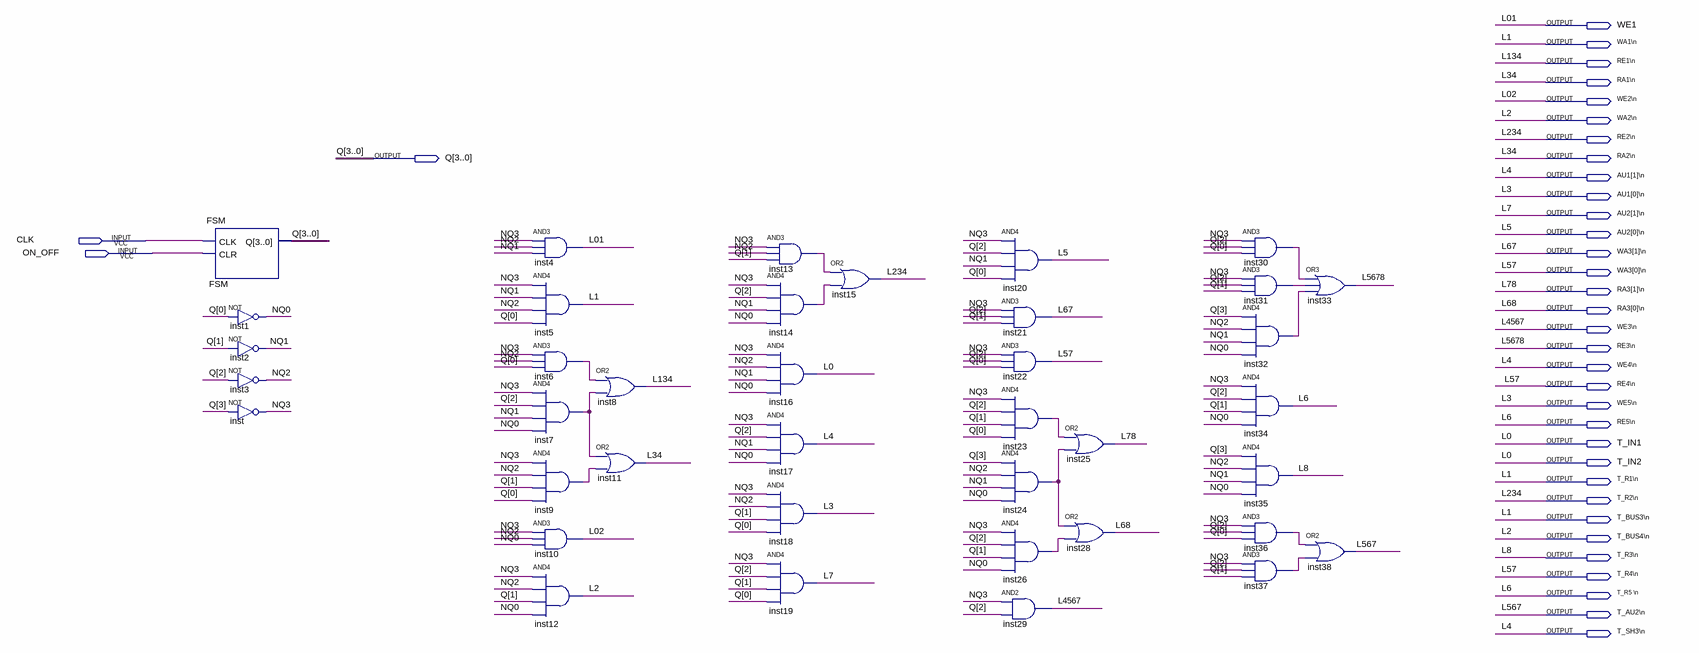
[diagram p0: schematic sheet]
// Quartus schematic NEW_CONTROLLER.bdf as structural Verilog: 39 symbols, 36 pins
module NEW_CONTROLLER (
  input  CLK,
  input  ON_OFF,
  output WE1,
  output \WA1\n ,
  output \RE1\n ,
  output \RA1\n ,
  output \WE2\n ,
  output \WA2\n ,
  output \RE2\n ,
  output [3:0] Q,
  output \RA2\n ,
  output \AU1[1]\n ,
  output \AU1[0]\n ,
  output \AU2[1]\n ,
  output \AU2[0]\n ,
  output \WA3[1]\n ,
  output \WA3[0]\n ,
  output \RA3[1]\n ,
  output \RA3[0]\n ,
  output \WE3\n ,
  output \RE3\n ,
  output \WE4\n ,
  output \RE4\n ,
  output \WE5\n ,
  output \RE5\n ,
  output T_IN1,
  output T_IN2,
  output \T_R1\n ,
  output \T_R2\n ,
  output \T_BUS3\n ,
  output \T_BUS4\n ,
  output \T_R3\n ,
  output \T_R4\n ,
  output \T_R5_\n ,
  output \T_AU2\n ,
  output \T_SH3\n 
);

  wire inst6_out, inst7_out, inst9_out, inst13_out, inst14_out, inst23_out, inst24_out, inst26_out,
       inst30_out, inst31_out, inst32_out, inst36_out, inst37_out, NQ0, NQ1, NQ2, NQ3;

  FSM FSM (.CLK(CLK), .CLR(ON_OFF), .Q(Q));
  not inst1 (NQ0, Q[0]);
  not inst2 (NQ1, Q[1]);
  not inst3 (NQ2, Q[2]);
  not inst (NQ3, Q[3]);
  and inst4 (WE1, NQ3, NQ2, NQ1);
  and inst5 (\T_BUS3\n , NQ3, NQ1, NQ2, Q[0]);
  and inst6 (inst6_out, NQ3, NQ2, Q[0]);
  and inst7 (inst7_out, NQ3, Q[2], NQ1, NQ0);
  and inst9 (inst9_out, NQ3, NQ2, Q[1], Q[0]);
  and inst10 (\WE2\n , NQ3, NQ2, NQ0);
  and inst12 (\T_BUS4\n , NQ3, NQ2, Q[1], NQ0);
  or inst8 (\RE1\n , inst6_out, inst7_out);
  or inst11 (\RA1\n , inst7_out, inst9_out);
  and inst13 (inst13_out, NQ3, NQ2, Q[1]);
  and inst14 (inst14_out, NQ3, Q[2], NQ1, NQ0);
  and inst16 (T_IN1, NQ3, NQ2, NQ1, NQ0);
  and inst17 (\AU1[1]\n , NQ3, Q[2], NQ1, NQ0);
  and inst18 (\AU1[0]\n , NQ3, NQ2, Q[1], Q[0]);
  and inst19 (\AU2[1]\n , NQ3, Q[2], Q[1], Q[0]);
  or inst15 (\RE2\n , inst13_out, inst14_out);
  and inst20 (\AU2[0]\n , NQ3, Q[2], NQ1, Q[0]);
  and inst21 (\WA3[1]\n , NQ3, Q[2], Q[1]);
  and inst22 (\RE4\n , NQ3, Q[2], Q[0]);
  and inst23 (inst23_out, NQ3, Q[2], Q[1], Q[0]);
  and inst24 (inst24_out, Q[3], NQ2, NQ1, NQ0);
  and inst26 (inst26_out, NQ3, Q[2], Q[1], NQ0);
  and inst29 (\WE3\n , NQ3, Q[2]);
  or inst25 (\RA3[1]\n , inst23_out, inst24_out);
  or inst28 (\RA3[0]\n , inst24_out, inst26_out);
  and inst30 (inst30_out, NQ3, Q[2], Q[0]);
  and inst31 (inst31_out, NQ3, Q[2], Q[1]);
  and inst32 (inst32_out, Q[3], NQ2, NQ1, NQ0);
  and inst34 (\RE5\n , NQ3, Q[2], Q[1], NQ0);
  and inst35 (\T_R3\n , Q[3], NQ2, NQ1, NQ0);
  and inst36 (inst36_out, NQ3, Q[2], Q[0]);
  and inst37 (inst37_out, NQ3, Q[2], Q[1]);
  or inst33 (\RE3\n , inst30_out, inst31_out, inst32_out);
  or inst38 (\T_AU2\n , inst36_out, inst37_out);

  assign \RA2\n  = \RA1\n ;
  assign T_IN2 = T_IN1;
  assign \T_R1\n  = \T_BUS3\n ;
  assign \T_R2\n  = \RE2\n ;
  assign \T_R4\n  = \RE4\n ;
  assign \T_R5_\n  = \RE5\n ;
  assign \T_SH3\n  = \AU1[1]\n ;
  assign \WA1\n  = \T_BUS3\n ;
  assign \WA2\n  = \T_BUS4\n ;
  assign \WA3[0]\n  = \RE4\n ;
  assign \WE4\n  = \AU1[1]\n ;
  assign \WE5\n  = \AU1[0]\n ;

  // Other names for the same wires on the sheet: L0 = T_IN1; L1 = \T_BUS3\n ; L01 = WE1; L2 = \T_BUS4\n ;
  //   L02 = \WE2\n ; L3 = \AU1[0]\n ; L4 = \AU1[1]\n ; L5 = \AU2[0]\n ; L6 = \RE5\n ; L7 = \AU2[1]\n ; L8 = \T_R3\n ;
  //   L34 = \RA1\n ; L57 = \RE4\n ; L67 = \WA3[1]\n ; L68 = \RA3[0]\n ; L78 = \RA3[1]\n ; L134 = \RE1\n ;
  //   L234 = \RE2\n ; L567 = \T_AU2\n ; L4567 = \WE3\n ; L5678 = \RE3\n 
endmodule
